# EAGLE design interface (EAGLE 6.6.0)
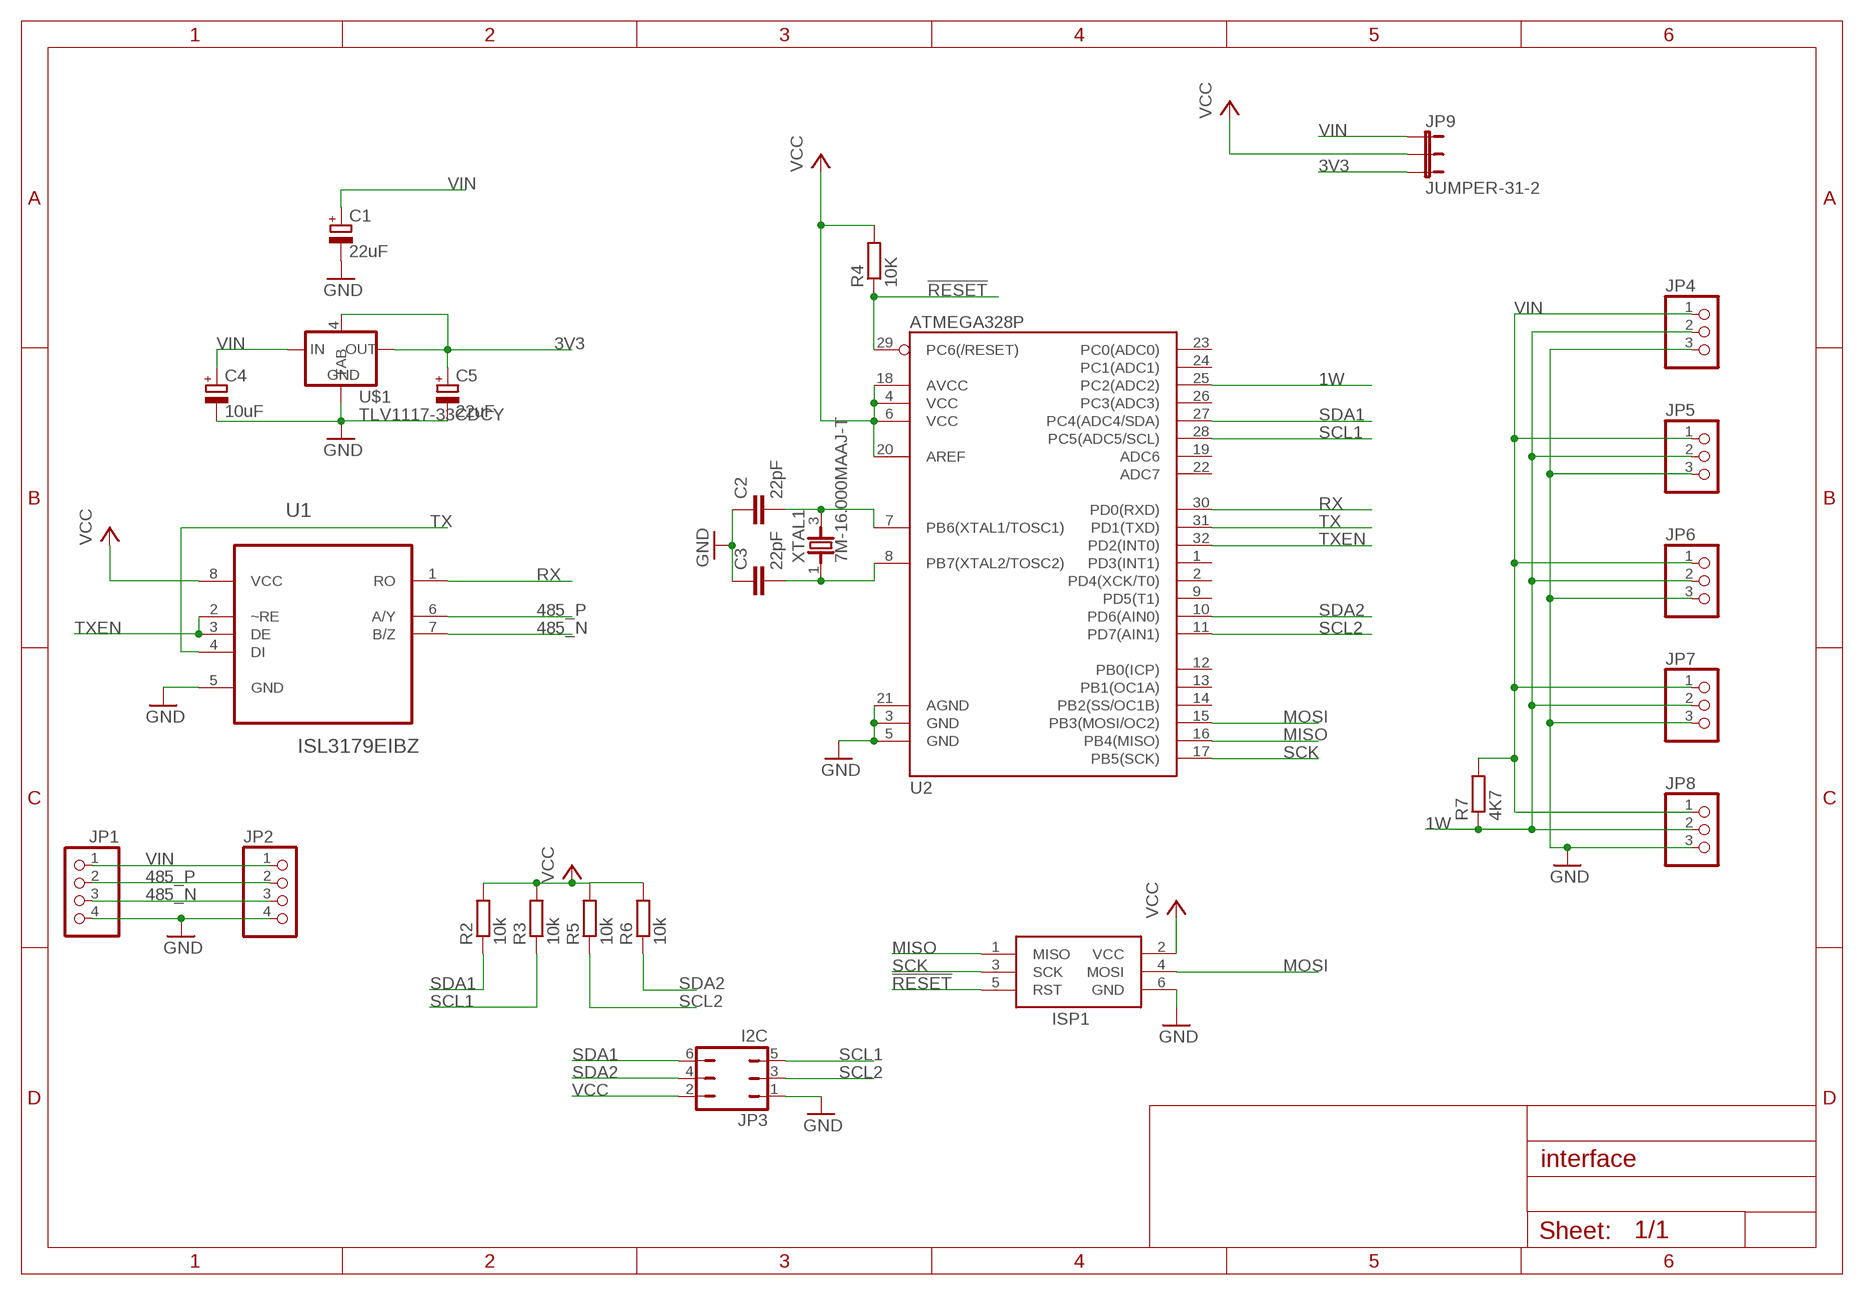
[diagram p0: schematic, sheet 1]

## Parts
C1  22uF  CPOL-EUA/3216-18R  [A/3216-18R]
C2  22pF  C-EUC0805  [C0805]
C3  22pF  C-EUC0805  [C0805]
C4  10uF  CPOL-EUA/3216-18R  [A/3216-18R]
C5  22uF  CPOL-EUA/3216-18R  [A/3216-18R]
ISP1  AVRISP-6  [AVRISP]
JP1  PINHD-1X4  [1X04]
JP2  PINHD-1X4  [1X04]
JP3  I2C  JP3Q  [JP3Q]
JP4  PINHD-1X3  [1X03]
JP5  PINHD-1X3  [1X03]
JP6  PINHD-1X3  [1X03]
JP7  PINHD-1X3  [1X03]
JP8  PINHD-1X3  [1X03]
JP9  JUMPER-31-2  [SJ_3_PASTE1&2]
R2  10k  R-EU_R0805  [R0805]
R3  10k  R-EU_R0805  [R0805]
R4  10K  R-EU_R0805  [R0805]
R5  10k  R-EU_R0805  [R0805]
R6  10k  R-EU_R0805  [R0805]
R7  4K7  R-EU_R0805  [R0805]
U1  ISL3179EIBZ  [SOIC127P600X175-8N]
U2  ATMEGA328P  ATMEGA328_SMT  [TQFP32-08]
U$1  TLV1117-33CDCY  [SOT223]
XTAL1  7M-16.000MAAJ-T  [TXC_7M-16.000MAAJ-T]

## Nets
1W: JP4.2 JP5.2 JP6.2 JP7.2 JP8.2 R7.1 U2.25(PC2(ADC2))
3V3: C5.+ JP9.3 U$1.2(OUT) U$1.4(TAB)
485_N [rs485]: JP1.3 JP2.3 U1.7(B/Z)
485_P [rs485]: JP1.2 JP2.2 U1.6(A/Y)
!RESET: ISP1.5(RST) R4.1 U2.29(PC6(/RESET))
GND: C1.- C2.1 C3.1 C4.- C5.- ISP1.6(GND) JP1.4 JP2.4 JP3.1 JP4.3 JP5.3 JP6.3 JP7.3 JP8.3 U1.5(GND) U2.3(GND) U2.5(GND) U2.21(AGND) U$1.1(GND)
MISO: ISP1.1(MISO) U2.16(PB4(MISO))
MOSI: ISP1.4(MOSI) U2.15(PB3(MOSI/OC2))
N$2: C2.2 U2.7(PB6(XTAL1/TOSC1)) XTAL1.3
N$3: C3.2 U2.8(PB7(XTAL2/TOSC2)) XTAL1.1
RX: U1.1(RO) U2.30(PD0(RXD))
SCK: ISP1.3(SCK) U2.17(PB5(SCK))
SCL1: JP3.5 R3.1 U2.28(PC5(ADC5/SCL))
SCL2: JP3.3 R5.1 U2.11(PD7(AIN1))
SDA1: JP3.6 R2.1 U2.27(PC4(ADC4/SDA))
SDA2: JP3.4 R6.1 U2.10(PD6(AIN0))
TX: U1.4(DI) U2.31(PD1(TXD))
TXEN: U1.2(~RE) U1.3(DE) U2.32(PD2(INT0))
VCC: ISP1.2(VCC) JP3.2 JP9.2 R2.2 R3.2 R4.2 R5.2 R6.2 U1.8(VCC) U2.4(VCC) U2.6(VCC) U2.18(AVCC) U2.20(AREF)
VIN: C1.+ C4.+ JP1.1 JP2.1 JP4.1 JP5.1 JP6.1 JP7.1 JP8.1 JP9.1 R7.2 U$1.3(IN)
Unconnected: U2.1(PD3(INT1)) U2.2(PD4(XCK/T0)) U2.9(PD5(T1)) U2.12(PB0(ICP)) U2.13(PB1(OC1A)) U2.14(PB2(SS/OC1B)) U2.19(ADC6) U2.22(ADC7) U2.23(PC0(ADC0)) U2.24(PC1(ADC1)) U2.26(PC3(ADC3))

## Library data of the parts
C1 C4 C5 = resistor:CPOL-EU: POLARIZED CAPACITOR, European symbol
C2 C3 = resistor:C-EU: CAPACITOR, European symbol
ISP1 = adafruit:AVRISP: AVR ISP HEADER Standard 6 pin header for AVR programming
JP1 JP2 = pinhead:PINHD-1X4: PIN HEADER
JP3 = jumper:JP3Q: JUMPER
JP4-JP8 = pinhead:PINHD-1X3: PIN HEADER
JP9 = SparkFun-Passives:JUMPER-3
R2-R7 = resistor:R-EU_: RESISTOR, European symbol
U1 = glacsweb:ISL3179EIBZ: TRANCEIVER; MPN: ISL3179EIBZ; OC_FARNELL: 1439860; OC_NEWARK: 58M7513; PACKAGE: SOIC-8; SUPPLIER: Intersil
U2 = SparkFun-DigitalIC:ATMEGA328_SMT: 32-Pin Atmega328 part Commonly used on Arduino compatible boards Available in QFP and QFN packages TQFP is IC-09069 QFN is non-stock; PROD_ID: IC-09069
U$1 = basestation:TLV1117-33CDCY: Texas Instruments 3.3v 800mA Voltage Regulator http://uk.farnell.com/texas-instruments/tlv1117-33cdcy/v-reg-ldo-3-3v-0-8a-sot-223-4/dp/1494942 Datasheet: http://focus.ti.com/lit/ds/symlink/tlv1117-33.pdf
XTAL1 = TXC-7M-16.000MAAJ-T:7M-16.000MAAJ-T: CRYSTAL SEAM, 16MHZ, 18PF, SMD; MPN: 7M-16.000MAAJ-T; OC_FARNELL: 1842060; OC_NEWARK: 84R5710; PACKAGE: SMD; SUPPLIER: TXC

## Net classes
1 rs485: width 0.305 mm, clearance 0.152 mm

## Board
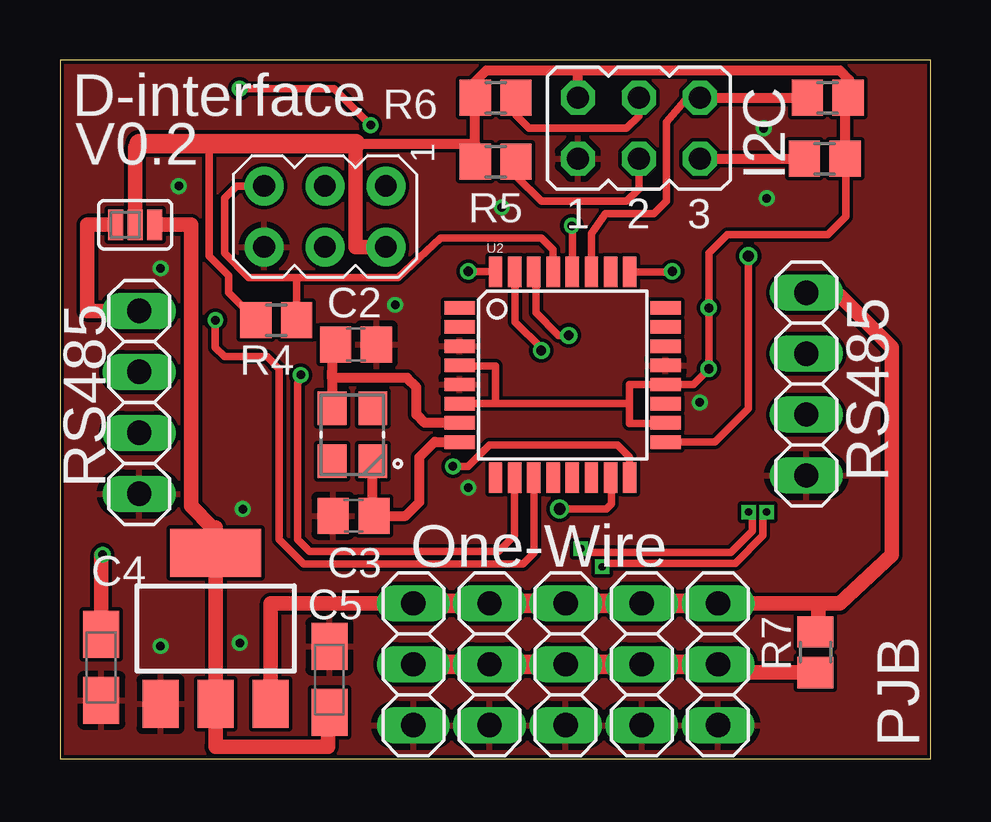
[diagram p1: board, top side]
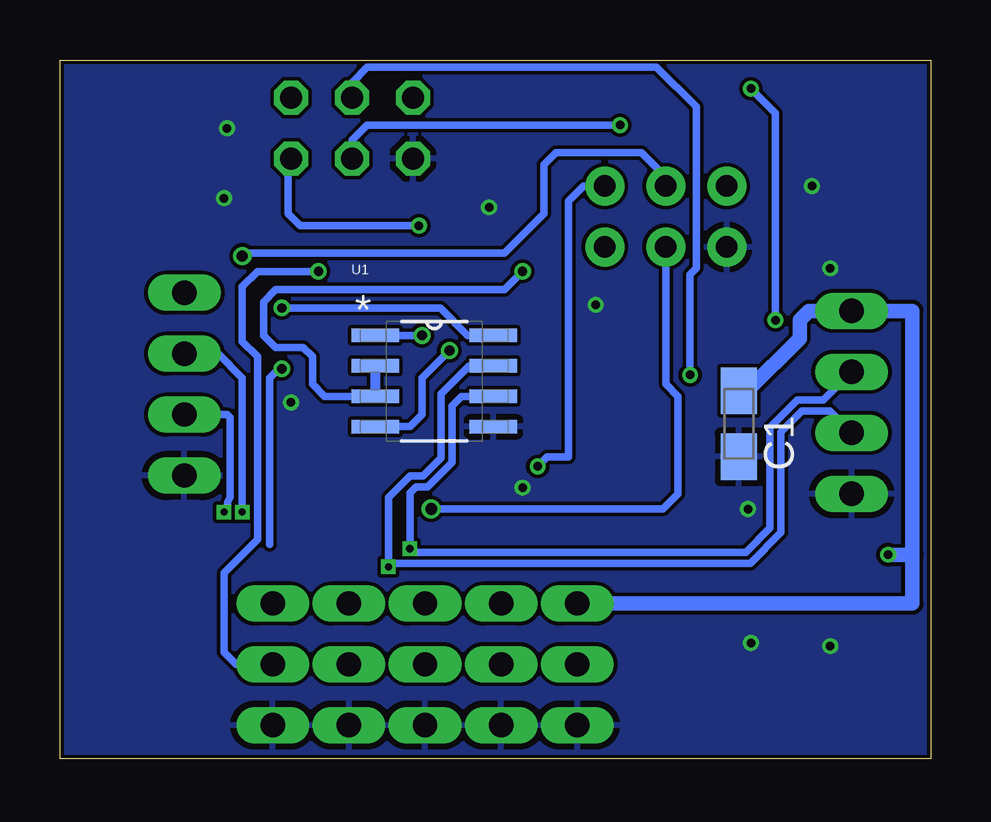
[diagram p2: board, bottom side, seen from below]

Size 36.3 x 29.13 mm. Coordinates in mm from the lower left corner, seen from the top.
Outline: 0,0 36.3,0 36.3,29.13 0,29.13 0,0
Copper layers (1*16): Top 0.035mm / dielectric 1.5mm / Bottom 0.035mm
Design rules "Hackvana *": minimum track width 6mil, minimum drill 0.3mm, track to track 6mil, track to pad 6mil, pad to pad 6mil, via to via 6mil, smd to smd 0mil, copper to edge 6mil, drill to drill 6mil, minimum pad ring 10mil, minimum via ring 6mil, stop-mask expansion 2mil, vias tented up to drill 100mil, thermal gap 10mil

### Footprints (pad centres in the part's own frame; a part is rotated, then mirrored left to right if it is on the bottom)
A/3216-18R = smd 1.95 x 1.5: + 1.375,0; - -1.375,0
C0805 = smd 1.3 x 1.5: 1 -0.85,0; 2 0.85,0
AVRISP = drill 0.9 pad 1.626: 1 -1.27,2.54; 2 1.27,2.54; 3 -1.27,0; 4 1.27,0; 5 -1.27,-2.54; 6 1.27,-2.54
1X04 = drill 1.016 long: 1 -3.81,0; 2 -1.27,0; 3 1.27,0; 4 3.81,0
JP3Q = drill 0.914 octagon: 1 -2.54,-1.27; 2 -2.54,1.27; 3 0,-1.27; 4 0,1.27; 5 2.54,-1.27; 6 2.54,1.27
1X03 = drill 1.016 long: 1 -2.54,0; 2 0,0; 3 2.54,0
SJ_3_PASTE1&2 = smd 0.635 x 1.27: 1 -0.813,0; 2 0,0; 3 0.813,0
R0805 = smd 1.3 x 1.5: 1 -0.85,0; 2 0.85,0
SOIC127P600X175-8N = smd 1.981 x 0.559: 1 -2.464,1.905; 2 -2.464,0.635; 3 -2.464,-0.635; 4 -2.464,-1.905; 5 2.464,-1.905; 6 2.464,-0.635; 7 2.464,0.635; 8 2.464,1.905
TQFP32-08 = smd 1.27 x 0.559: 1 -4.293,2.8; 2 -4.293,2; 3 -4.293,1.2; 4 -4.293,0.4; 5 -4.293,-0.4; 6 -4.293,-1.2; 7 -4.293,-2; 8 -4.293,-2.8; 17 4.293,-2.8; 18 4.293,-2; 19 4.293,-1.2; 20 4.293,-0.4; 21 4.293,0.4; 22 4.293,1.2; 23 4.293,2; 24 4.293,2.8 | smd 0.559 x 1.27: 9 -2.8,-4.293; 10 -2,-4.293; 11 -1.2,-4.293; 12 -0.4,-4.293; 13 0.4,-4.293; 14 1.2,-4.293; 15 2,-4.293; 16 2.8,-4.293; 25 2.8,4.293; 26 2,4.293; 27 1.2,4.293; 28 0.4,4.293; 29 -0.4,4.293; 30 -1.2,4.293; 31 -2,4.293; 32 -2.8,4.293
SOT223 = smd 1.5 x 2: 1 -2.3,-3.15; 2 0,-3.15; 3 2.3,-3.15 | smd 3.8 x 2: 4 0,3.15
TXC_7M-16.000MAAJ-T = smd 1.4 x 1.2: 1 -1.1,-0.85; 2 1.1,-0.85; 3 1.1,0.85; 4 -1.1,0.85

### Placement (x,y rotation side)
C1  8,13.97 90 bottom
C2  12.34,17.27 180 top
C3  12.24,10.13 0 top
C4  1.72,3.81 90 top
C5  11.23,3.31 270 top
ISP1  11.05,22.61 270 top
JP1  3.3,14.86 270 top
JP2  31.11,15.62 270 top
JP3  24.13,26.29 0 top
JP4  27.43,3.94 270 top
JP5  24.26,3.94 270 top
JP6  21.08,3.94 270 top
JP7  17.91,3.94 270 top
JP8  14.73,3.94 270 top
JP9  3.14,22.26 0 top
R2  32,27.56 0 top
R3  31.88,25.02 0 top
R4  9.02,18.29 180 top
R5  18.16,24.89 180 top
R6  18.16,27.56 180 top
R7  31.5,4.45 90 top
U1  20.7,15.75 0 bottom
U2  20.95,16 0 top
U$1  6.49,5.43 0 top
XTAL1  12.19,13.5 90 top

### Tracks (layer width: path | path; a pad name or v marks a point on that pad's centre or on a via)
1W  (via drill 0.38)
  Top 0.305: U2.25 25.5,20.3 v25.53,20.32
  Top 0.61: R7.1 27.43,3.59
  Top 0.813: JP8.2 JP7.2 JP6.2 JP5.2 JP4.2 27.43,3.59
  Bottom 0.305: JP4.2 28.96,3.94 29.46,4.45 29.46,7.75 28.07,9.14 28.07,16.76 28.7,17.4 28.7,19.69 28.07,20.32 v25.53,20.32
3V3
  Top 0.61: JP9.3 5.46,22.26 5.46,10.54 6.35,9.65 6.48,9.65 6.49,9.64 U$1.4 U$1.2 6.49,0.51 11.18,0.51 11.18,2.31 C5.+
485_N  (via drill 0.3)
  Top 0.305: v22.61,8 22.61,8.15 28.16,8.15 29.31,9.3 29.31,10.29 v29.46,10.29
  Bottom 0.305: JP1.3 4.22,14.5 5.37,14.5 6.25,13.62 6.25,9.43 7.52,8.15 22.61,8.15 v22.61,8 22.61,10.9 21.72,11.79 21.18,11.79 20.42,12.54 20.42,15.21 19.25,16.38 U1.7 | v29.46,10.29 29.31,10.29 29.31,10.69 29.21,10.92 29.21,14.22 29.34,14.35 JP2.3 30.84,14.35
485_P  (via drill 0.3)
  Top 0.305: v21.72,8.76 21.72,8.61 27.97,8.61 28.85,9.49 28.85,10.29 v28.7,10.29
  Bottom 0.305: JP1.2 4.47,14.96 5.56,14.96 6.71,13.81 6.71,9.62 7.71,8.61 21.72,8.61 v21.72,8.76 21.72,11.07 21.46,11.33 20.99,11.33 19.96,12.35 19.96,14.71 19.56,15.11 U1.6 | 28.55,10.29 v28.7,10.29 28.7,15.88 29.72,16.89 JP2.2
!RESET
  Top 0.305: ISP1.5 7.37,23.88 6.86,23.37 6.86,21.08 7.87,20.07 9.91,20.07 | U2.29 20.55,21.23 20.07,21.72 15.87,21.72 14.1,20.07 9.91,20.07 | R4.1 9.87,20.03 9.91,20.07
GND  (via drill 0.36 pad 0.51)
  other vias: 29.34,26.29 7.62,10.41 17.02,11.3 4.95,23.88 4.19,20.45 7.49,4.83 4.19,4.7 26.67,14.86 29.46,23.37 13.97,18.92 18.41,22.99
  pour Top: -0.64,32.38 38.61,30.99 38.99,-1.91 -1.52,-3.05
  pour Bottom: -0.68,30.39 37.85,29.72 37.46,-0.76 -0.13,-2.03
MISO  (via drill 0.36 pad 0.51)
  Top 0.305: U2.16 23.75,12.57 23.24,13.08 17.91,13.08 17.02,12.19 v16.38,12.19
  Bottom 0.305: ISP1.1 14.48,23.88 15.11,23.24 15.11,12.57 16,12.57 v16.38,12.19
MOSI  (via drill 0.48)
  Top 0.305: v20.83,10.41 22.78,10.41 22.99,10.62 22.99,11.68 U2.15
  Bottom 0.305: ISP1.4 11.05,15.62 10.54,15.11 10.54,11.05 11.18,10.41 v20.83,10.41
N$2
  Top 0.406: C2.2 11.34,17.27 11.34,16.13 11.34,15.88 | 11.34,15.88 XTAL1.3 | U2.7 15.21,14 14.86,14.35 14.86,15.49 14.48,15.88 11.34,15.88
N$3
  Top 0.406: XTAL1.1 13.04,10.13 C3.2 14.41,10.13 14.99,10.71 14.99,12.58 15.62,13.21 U2.8
RX  (via drill 0.41)
  Top 0.305: v21.21,17.65 20.78,17.65 19.84,18.59 19.84,20.21 U2.30
  Bottom 0.305: U1.1 v21.21,17.65
SCK  (via drill 0.46)
  Top 0.305: U2.17 27.3,13.2 28.7,14.6 v28.7,20.96
  Bottom 0.305: v28.7,20.96 28.7,21.08 17.78,21.08 16.13,22.73 16.13,24.77 15.62,25.27 12.06,25.27 11.05,24.26 ISP1.3
SCL1  (via drill 0.36 pad 0.51)
  Top 0.305: U2.28 21.35,22.21 v21.34,22.23
  Top 0.406: JP3.5 R3.1
  Bottom 0.305: v21.34,22.23 26.29,22.23 26.8,22.73 26.8,24.89 JP3.5
SCL2  (via drill 0.36 pad 0.51)
  Top 0.305: R5.1 19.01,24.3 20.07,23.24 23.62,23.24 24.13,23.75 JP3.3 | U2.11 19.75,8.58 19.3,8.13 10.16,8.13 9.14,9.14 9.14,16.26 8.64,16.76 6.86,16.76 6.48,17.14 v6.48,18.29 | v7.49,27.94 11.43,27.94 v12.95,26.42
  Bottom 0.305: v6.48,18.29 6.48,26.92 v7.49,27.94 | v12.95,26.42 23.49,26.42 24.13,25.78 JP3.3
SDA1
  Top 0.305: U2.27 22.15,21.9 22.73,22.73 24.76,22.73 25.27,23.24 25.27,26.54 26.16,27.56 JP3.6
  Top 0.406: JP3.6 R2.1
SDA2  (via drill 0.36 pad 0.51)
  Top 0.305: R6.1 19.01,26.84 19.56,26.29 23.62,26.29 24.13,26.8 JP3.4 | U2.10 18.95,9.3 18.29,8.64 10.41,8.64 9.91,9.14 9.91,15.62 v10.03,16
  Bottom 0.305: v10.03,16 10.03,20.19 9.78,20.45 9.78,27.18 11.43,28.83 23.49,28.83 24.13,28.19 JP3.4
TX  (via drill 0.41)
  Top 0.305: v20.07,17.02 20.07,17.12 18.97,18.21 18.97,20.28 U2.31
  Bottom 0.305: U1.4 21.72,13.84 21.21,14.35 21.21,15.88 v20.07,17.02
TXEN  (via drill 0.38)
  Top 0.305: v17.02,20.32 18.13,20.32 U2.32
  Bottom 0.305: U1.3 25.27,15.11 25.78,15.62 25.78,16.76 26.16,17.14 27.3,17.14 27.81,17.65 27.81,19.05 27.3,19.56 17.78,19.56 v17.02,20.32
  Bottom 0.406: U1.2 U1.3
VCC  (via drill 0.38)
  Top 0.305: U2.6 18.16,14.8 | 18.16,14.8 18.16,16.38 16.66,16.38 U2.4 | 23.75,14.8 23.75,15.6 U2.20 26.4,15.6 v27.05,16.26 v27.05,18.8 27.05,21.08 27.81,21.84 32,21.84 32.77,22.61 32.77,24.98 R3.2 | 23.75,14.8 23.75,13.97 25.25,13.97 U2.18 | 18.16,14.8 23.75,14.8 | 6.35,25.65 6.22,25.53 6.22,20.96 7.02,20.15 7.02,19.43 R4.2
  Top 0.406: R5.2 17.31,25.65 | 17.31,25.65 R6.2 17.31,28.23 17.78,28.7 21.46,28.7 | 12.32,25.65 17.31,25.65 | R3.2 32.73,27.56 R2.2 32.89,27.6 32.89,28.32 32.51,28.7 21.46,28.7 | JP3.2 21.59,28.58 21.46,28.7
  Top 0.61: ISP1.2 12.32,21.34 12.32,25.65 | JP9.2 3.14,25.49 3.3,25.65
  Top 0.813: 12.32,25.65 6.35,25.65 3.3,25.65
  Bottom 0.305: U1.8 19.3,17.65 20.45,18.8 v27.05,18.8 | 27.56,8.93 27.56,15.88 27.18,16.26 v27.05,16.26
VIN  (via drill 0.36 pad 0.51)
  Top 0.61: JP4.1 31.62,6.48 | 31.62,6.48 32.51,6.48 34.67,8.51 34.67,17.14 32.51,19.3 JP2.1 | JP9.1 1.14,22.26 1.14,18.67 JP1.1 | U$1.3 8.79,6.48 JP8.1 | C4.+ 1.72,8.51 v1.78,8.51 | R7.2 31.62,5.29 31.62,6.48
  Top 0.813: JP4.1 JP5.1 JP6.1 JP7.1 JP8.1
  Bottom 0.61: JP8.1 0.76,6.48 0.76,8.51 | 0.76,8.51 0.76,18.67 JP1.1 5.08,18.67 5.46,18.29 5.46,17.53 7.64,15.34 C1.+ | v1.78,8.51 0.76,8.51

### Text on the board
tNames: D-interface | V0.2 | I2C | RS485 | RS485 | One-Wire | PJB